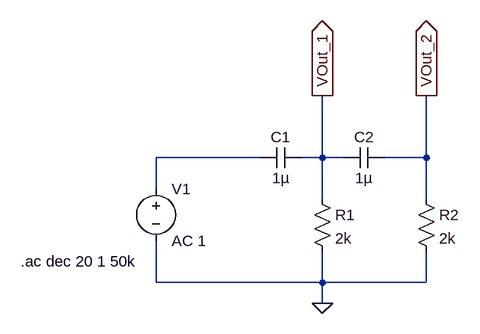
[diagram p0: schematic second order design.asc]
second order design.asc, the LTspice schematic file:
Version 4
SHEET 1 880 680
WIRE 224 80 64 80
WIRE 320 80 320 -16
WIRE 320 80 288 80
WIRE 352 80 320 80
WIRE 480 80 480 -16
WIRE 480 80 416 80
WIRE 64 128 64 80
WIRE 320 144 320 80
WIRE 480 144 480 80
WIRE 64 272 64 208
WIRE 320 272 320 224
WIRE 320 272 64 272
WIRE 480 272 480 224
WIRE 480 272 320 272
WIRE 320 304 320 272
FLAG 320 304 0
FLAG 320 -16 VOut_1
IOPIN 320 -16 Out
FLAG 480 -16 VOut_2
IOPIN 480 -16 Out
SYMBOL voltage 64 112 R0
SYMATTR InstName V1
SYMATTR Value AC 1
SYMBOL cap 288 64 R90
WINDOW 0 0 32 VBottom 2
WINDOW 3 32 32 VTop 2
SYMATTR InstName C1
SYMATTR Value 1µ
SYMBOL cap 416 64 R90
WINDOW 0 0 32 VBottom 2
WINDOW 3 32 32 VTop 2
SYMATTR InstName C2
SYMATTR Value 1µ
SYMBOL res 304 128 R0
SYMATTR InstName R1
SYMATTR Value 2k
SYMBOL res 464 128 R0
SYMATTR InstName R2
SYMATTR Value 2k
TEXT -144 240 Left 2 !.ac dec 20 1 50k

The netlist it stands for:
* second order design.asc
V1 N001 0 AC 1
C1 VOut_1 N001 1µ
C2 VOut_2 VOut_1 1µ
R1 VOut_1 0 2k
R2 VOut_2 0 2k
.ac dec 20 1 50k
.backanno
.end